# EAGLE schematic 2021-05-03 Coll-Interface (EAGLE 9.6.2)
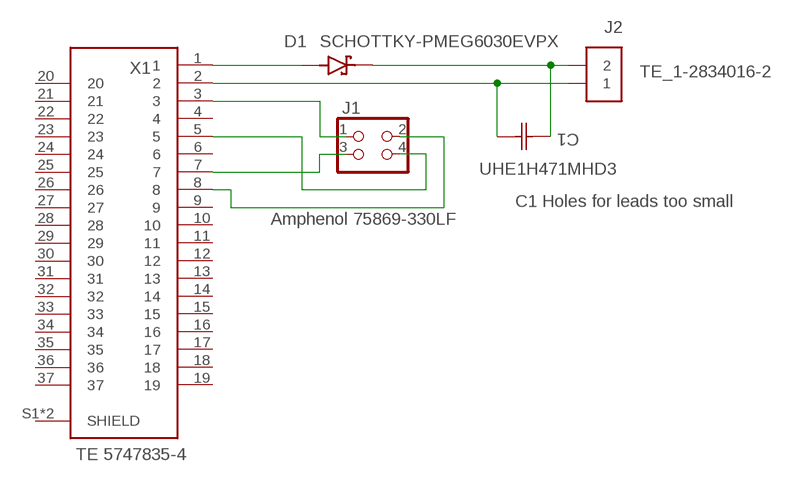
[diagram p0: schematic, sheet 1]

## Parts
C1  UHE1H471MHD3  ELECTROLYTIC_UHE1H471MHD3  [U1-EE_NCH]
D1  SCHOTTKY-PMEG6030EVPX  [DIO_PMEG6030EVPX]
J1  Amphenol 75869-330LF  PINHD-2X2AMP-75869-130LF  [2X02-SHROUD]
J2  TE_1-2834016-2  TERMINAL_BLOCK_2PIN_1-2834016-2  [TE_1-2834016-2]
X1  TE 5747835-4  DE-37-TE-CONNECTIVITY-5747835-4  [TE_5747835-4]

## Nets
+24V-FROM-SPECMECH: D1.2(A) X1.1
+24V-TO-ROBOCLAW: C1.1 D1.1(K) J2.2.1 J2.2.2
GND-ROBOCLAW: C1.2 J2.1.1 J2.1.2 X1.2
GND-SPECMECH: J1.4 X1.5
ROBO-RX: J1.1 X1.3
ROBO-TX: J1.3 X1.7
VCC-SPECMECH: J1.2 X1.8
Unconnected: X1.4 X1.6 X1.9 X1.10 X1.11 X1.12 X1.13 X1.14 X1.15 X1.16 X1.17 X1.18 X1.19 X1.20 X1.21 X1.22 X1.23 X1.24 X1.25 X1.26 X1.27 X1.28 X1.29 X1.30 X1.31 X1.32 X1.33 X1.34 X1.35 X1.36 X1.37 X1.S1(SHIELD) X1.S2(SHIELD)

## Notes on the sheet
- C1 Holes for leads too small

## Library data of the parts
C1 = AUmlib:ELECTROLYTIC_UHE1H471MHD3; BUILT_BY: EMA_UL_Team; MANUFACTURER_PART_NUMBER: UHE1H471MHD3; SOURCELIBRARY: Nichicon_2014-12-31; VENDOR: Nichicon
D1 = AUmlib:SCHOTTKY-PMEG6030EVPX: PMEG6030 Series 60 V 3 A Surface Mount Schottky Barrier Rectifier - SOD-128; DESCRIPTION: Diode Schottky 60V 3A Surface Mount SOD-128/CFP5; DIGI-KEY_PART_NUMBER: 1727-1349-1-ND; MF: Nexperia USA; MP: PMEG6030EVPX; PACKAGE: CFP5-2 Nexperia USA Inc.; PURCHASE-URL: https://pricing.snapeda.com/search/part/PMEG6030EVPX/?ref=eda
J1 = AUmlib:PINHD-2X2: PIN HEADER
J2 = AUmlib:TERMINAL_BLOCK_2PIN_1-2834016-2: PCB Terminal Blocks, Receptacle, Wire-to-Board, 2 Positions, 1 Rows, Side Wire Entry Angle, 26 – 20AWG Wire Size, 6A Current Rating (Max), 300 VAC; COMMENT: 1-2834016-2; DESCRIPTION: Conn PC Terminal Block 2 POS 2.54mm Solder ST Thru-Hole 6A/Contact Box/Carton; DIGI-KEY_PART_NUMBER: A123829-ND; EU_ROHS_COMPLIANCE: Compliant; MF: TE Connectivity; MP: 1-2834016-2; PACKAGE: None; PURCHASE-URL: https://pricing.snapeda.com/search/part/1-2834016-2/?ref=eda
X1 = AUmlib:DE-37-TE-CONNECTIVITY-5747835-4: 37 MSFL PLUG RA 590 (IN,FM,BL); CENTERLINE_PITCH: 2.74 mm[.108 in]; COMMENT: 5747835-4; DESCRIPTION: 37 MSFL PLUG RA 590 (IN,FM,BL); DIGI-KEY_PART_NUMBER: A32082-ND; MF: TE Connectivity; MP: 5747835-4; NUMBER_OF_POSITIONS: 37; PACKAGE: None; PRODUCT_TYPE: Connector; PURCHASE-URL: https://pricing.snapeda.com/search/part/5747835-4/?ref=eda